# EAGLE design LED assembly (EAGLE 9.6.2)
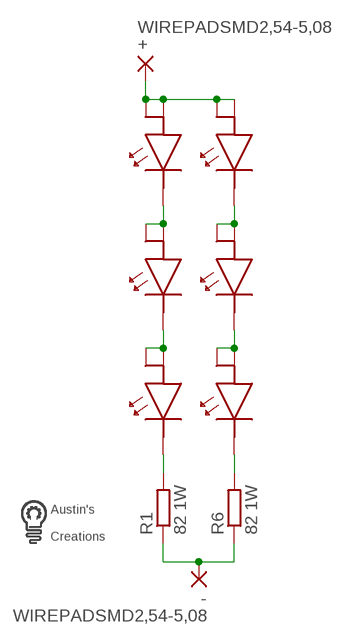
[diagram p0: schematic, sheet 1]

## Parts
+  WIREPADSMD2,54-5,08  [SMD2,54-5,08]
-  WIREPADSMD2,54-5,08  [SMD2,54-5,08]
R1  82 1W  R-EU_R2010  [R2010]
R6  82 1W  R-EU_R2010  [R2010]
U$1  LOGOMED  [LOGOMED]
U$6  5730LED  [5730LED]
U$7  5730LED  [5730LED]
U$8  5730LED  [5730LED]
U$23  5730LED  [5730LED]
U$24  5730LED  [5730LED]
U$25  5730LED  [5730LED]

## Nets
N: U$6.P$2 U$7.P$1 U$7.P$3
N$4: -.1(P) R1.1 R6.1
N$9: U$7.P$2 U$8.P$1 U$8.P$3
N$10: R1.2 U$8.P$2
N$19: U$23.P$2 U$24.P$1 U$24.P$3
N$20: U$24.P$2 U$25.P$1 U$25.P$3
N$24: R6.2 U$25.P$2
VIN: +.1(P) U$6.P$1 U$6.P$3 U$23.P$1 U$23.P$3

## Library data of the parts
+ - = wirepad:WIREPAD: Wire PAD connect wire on PCB
R1 R6 = rcl:R-EU_: RESISTOR, European symbol; SPICEPREFIX: R
U$1 = custom parts:LOGOMED
U$6-U$8 U$23-U$25 = custom parts:5730LED

## Board
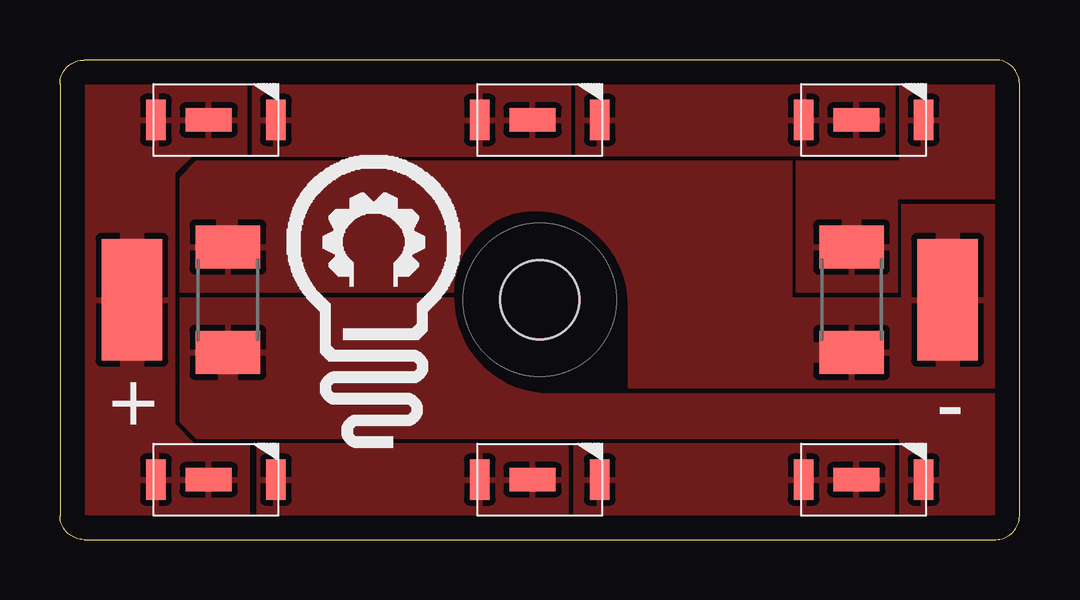
[diagram p1: board, top side]
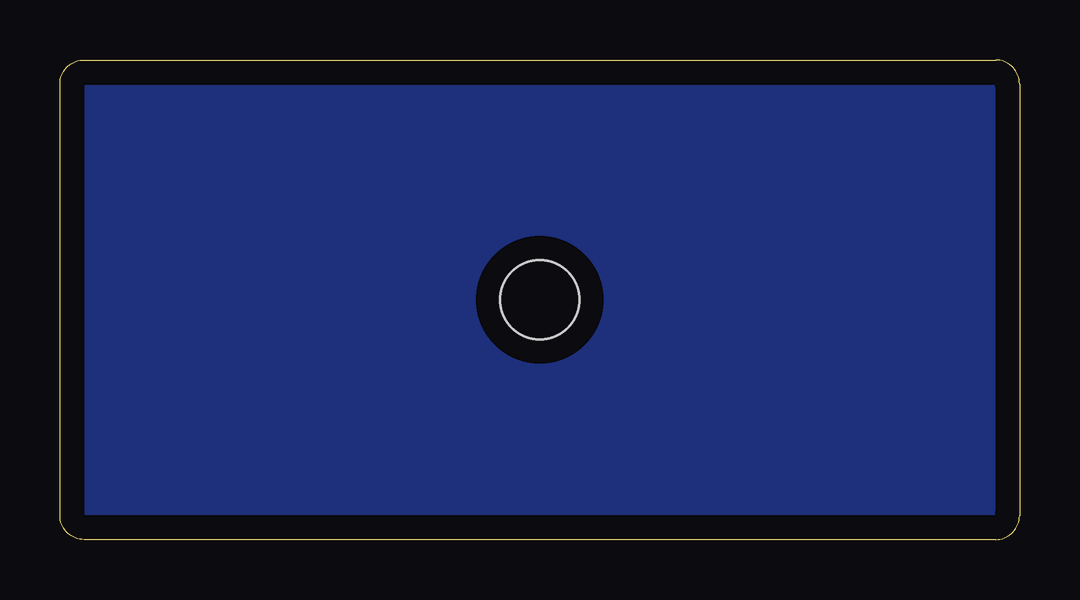
[diagram p2: board, bottom side, seen from below]

Size 40 x 20 mm. Coordinates in mm from the lower left corner, seen from the top.
Outline: 1,0 39,0 arc90 40,1 40,19 arc90 39,20 1,20 arc90 0,19 0,1 arc90 1,0
Copper layers (1*16): Top 0.035mm / dielectric 1.5mm / Bottom 0.035mm
Design rules "default": minimum track width 6mil, minimum drill 0.35mm, track to track 6mil, track to pad 6mil, pad to pad 6mil, via to via 6mil, smd to smd 6mil, copper to edge 40mil, drill to drill 6mil, minimum pad ring 10mil, minimum via ring 8mil, stop-mask expansion 4mil, vias tented up to drill 0mil, thermal gap 10mil
Holes 3.3 mm at 20,10

### Footprints (pad centres in the part's own frame; a part is rotated, then mirrored left to right if it is on the bottom)
SMD2,54-5,08 = smd 2.54 x 5.08: 1 0,0
R2010 = smd 1.8 x 2.7: 1 -2.2,0; 2 2.2,0
5730LED = smd 0.813 x 1.676: P$1 -2.5,0; P$2 2.5,0 | smd 1.93 x 0.965: P$3 -0.3,0

### Placement (x,y rotation side)
+  3,10 0 top
-  37,10 0 top
R1  7,10 270 top
R6  33,10 90 top
U$1  8.8,3.5 0 top
U$6  6.5,2.5 0 top
U$7  20,2.5 0 top
U$8  33.5,2.5 0 top
U$23  6.5,17.5 0 top
U$24  20,17.5 0 top
U$25  33.5,17.5 0 top

### Tracks (layer width: path | path; a pad name or v marks a point on that pad's centre or on a via)
GND
  pour Bottom (no thermals): 0,20 0,0 40,0 40,20
N
  pour Top: 8.2,4 8.2,0 21.2,0 21.2,4
N$4
  pour Top: 35.1,14 40,14 40,6.3 23.75,6.3 23.7,6.35 23.7,9.8 arc90 19.8,13.7 arc90 16.4,10.3 5,10.3 5,15.1 5.7,15.8 30.5,15.8 30.5,10.1 35.1,10.1
  pour Top (no thermals): 6.5,13.4 6.5,13 7.4,13 7.4,13.4
  pour Top (no thermals): 31.7,8.2 31.3,8.2 31.3,7.4 31.7,7.4
  pour Top (no thermals): 36.5,12.8 36.5,7.1 37.5,7.1 37.5,12.9 36.5,12.9
N$9
  pour Top: 21.4,4 21.4,0 34.8,0 34.8,4
N$10
  pour Top: 5,10.1 16.4,10.1 arc90 20.4,6.1 40,6.1 40,0 35,0 35,4.2 5.7,4.2 5,4.9
  pour Top (no thermals): 6.6,6.9 6.6,6.6 7.4,6.6 7.4,7 6.6,7
N$19
  pour Top: 8,20 8,16 21.3,16 21.3,20
N$20
  pour Top (isolate 0.254): 21.5,16 21.5,20 34.8,20 34.8,16
N$24
  pour Top (isolate 0.305): 35,15.8 35,20 40,20 40,14.2 34.9,14.2 34.9,10.3 30.7,10.3 30.7,15.8
  pour Top (no thermals): 32.6,13.4 32.6,13.1 33.4,13.1 33.4,13.4
VIN
  pour Top: 0,20 0,0 7.9,0 7.9,4 5.6,4 4.8,4.8 4.8,15.3 5.5,16 7.8,16 7.8,20
  pour Top (no thermals): 2.5,13.1 2.5,7.2 3.5,7.2 3.5,13.1